# Altium schematic sheet main.SchDoc
size A4; SheetNumber: 1; SheetTotal: 1
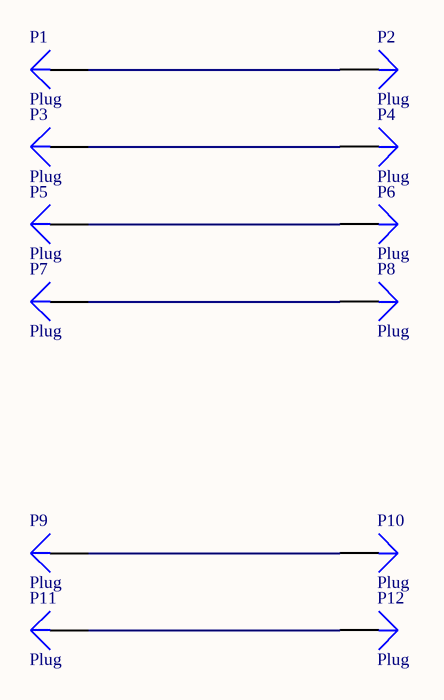
[diagram p0: main.SchDoc]

## Parts
P1  Plug  [PIN_CONN]
P2  Plug  [PIN_CONN]
P3  Plug  [PIN_CONN]
P4  Plug  [PIN_CONN]
P5  Plug  [PIN_CONN]
P6  Plug  [PIN_CONN]
P7  Plug  [PIN_CONN]
P8  Plug  [PIN_CONN]
P9  Plug  [PIN_CONN]
P10  Plug  [PIN_CONN]
P11  Plug  [PIN_CONN]
P12  Plug  [PIN_CONN]

## Nets
NetP1_1: P1.1 P2.1
NetP3_1: P3.1 P4.1
NetP5_1: P5.1 P6.1
NetP7_1: P7.1 P8.1
NetP9_1: P9.1 P10.1
NetP11_1: P11.1 P12.1

## Library data of the parts
P1-P12 = Plug: LatestRevisionDate: 17-Jul-2002; LatestRevisionNote: Re-released for DXP Platform.; Publisher: Altium Limited